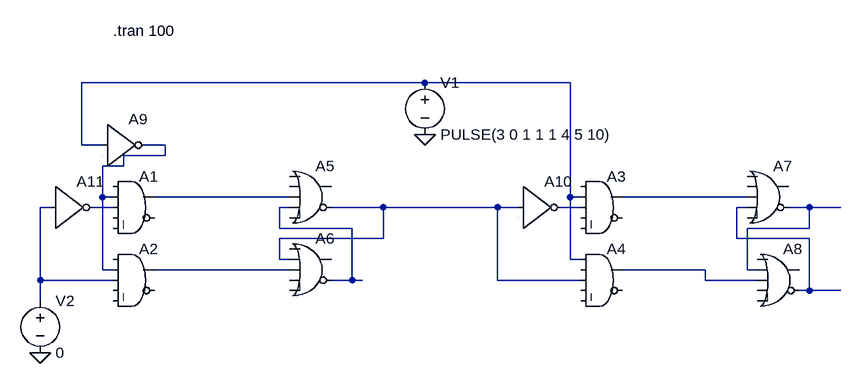
[diagram p0: schematic Actividad_7.asc]
Actividad_7.asc, the LTspice schematic file:
Version 4
SHEET 1 900 680
WIRE 192 32 -336 32
WIRE 416 32 192 32
WIRE -336 128 -336 32
WIRE -304 128 -336 128
WIRE -208 128 -240 128
WIRE -208 144 -208 128
WIRE -208 144 -272 144
WIRE -272 160 -272 144
WIRE -272 160 -304 160
WIRE -304 208 -304 160
WIRE -288 208 -304 208
WIRE -16 208 -224 208
WIRE 416 208 416 32
WIRE 432 208 416 208
WIRE 688 208 496 208
WIRE -384 224 -400 224
WIRE -288 224 -320 224
WIRE -16 224 -32 224
WIRE 128 224 48 224
WIRE 304 224 128 224
WIRE 336 224 304 224
WIRE 432 224 400 224
WIRE 688 224 672 224
WIRE 784 224 752 224
WIRE 832 224 784 224
WIRE -32 256 -32 224
WIRE 80 256 -32 256
WIRE 784 256 784 224
WIRE 784 256 688 256
WIRE 128 272 128 224
WIRE 128 272 -32 272
WIRE 672 272 672 224
WIRE 784 272 672 272
WIRE -32 304 -32 272
WIRE -16 304 -32 304
WIRE 416 304 416 208
WIRE 432 304 416 304
WIRE -304 320 -304 208
WIRE -288 320 -304 320
WIRE -16 320 -224 320
WIRE 624 320 496 320
WIRE 688 320 688 256
WIRE 704 320 688 320
WIRE -400 336 -400 224
WIRE -288 336 -400 336
WIRE 80 336 80 256
WIRE 80 336 48 336
WIRE 96 336 80 336
WIRE 304 336 304 224
WIRE 432 336 304 336
WIRE 624 336 624 320
WIRE 704 336 624 336
WIRE 784 352 784 272
WIRE 784 352 768 352
WIRE 832 352 784 352
WIRE -400 368 -400 336
FLAG 192 112 0
FLAG -400 448 0
SYMBOL voltage 192 16 R0
WINDOW 123 0 0 Left 2
WINDOW 39 0 0 Left 2
SYMATTR InstName V1
SYMATTR Value PULSE(3 0 1 1 1 4 5 10)
SYMBOL Digital\\and -256 160 R0
SYMATTR InstName A1
SYMBOL Digital\\and -256 272 R0
SYMATTR InstName A2
SYMBOL Digital\\and 464 160 R0
SYMATTR InstName A3
SYMBOL Digital\\and 464 272 R0
SYMATTR InstName A4
SYMBOL Digital\\or 16 144 R0
SYMATTR InstName A5
SYMBOL Digital\\or 16 256 R0
SYMATTR InstName A6
SYMBOL Digital\\or 720 144 R0
SYMATTR InstName A7
SYMBOL Digital\\or 736 272 R0
SYMATTR InstName A8
SYMBOL Digital\\inv -304 64 R0
SYMATTR InstName A9
SYMBOL Digital\\inv 336 160 R0
SYMATTR InstName A10
SYMBOL Digital\\inv -384 160 R0
SYMATTR InstName A11
SYMBOL voltage -400 352 R0
WINDOW 123 0 0 Left 2
WINDOW 39 0 0 Left 2
SYMATTR InstName V2
SYMATTR Value 0
TEXT -288 -48 Left 2 !.tran 100

The netlist it stands for:
* Actividad_7.asc
V1 N001 0 PULSE(3 0 1 1 1 4 5 10)
A1 0 N002 N006 0 0 0 N003 0 AND
A2 0 N002 N005 0 0 0 N012 0 AND
A3 0 N001 N009 0 0 0 N004 0 AND
A4 N001 0 N008 0 0 0 N013 0 AND
A5 0 0 N003 N007 0 N008 0 0 OR
A6 0 N008 N012 0 0 N007 0 0 OR
A7 0 0 N004 N010 0 N011 0 0 OR
A8 0 N011 N013 0 0 N010 0 0 OR
A9 N001 0 0 0 0 N002 0 0 BUF
A10 N008 0 0 0 0 N009 0 0 BUF
A11 N005 0 0 0 0 N006 0 0 BUF
V2 N005 0 0
.tran 100
.backanno
.end